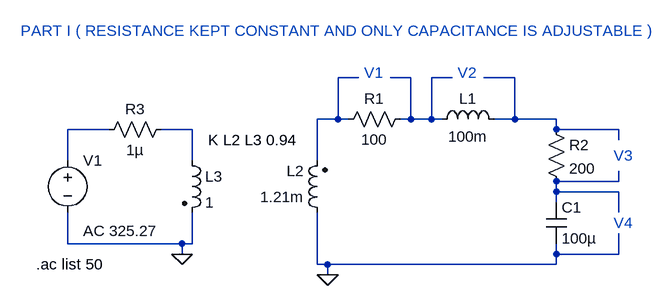
[diagram p0: schematic EXP1_PART1_CIRCUITO1.asc]
EXP1_PART1_CIRCUITO1.asc, the LTspice schematic file:
Version 4
SHEET 1 880 680
WIRE 80 32 48 32
WIRE 160 32 128 32
WIRE 224 32 192 32
WIRE 320 32 272 32
WIRE 48 96 48 32
WIRE 48 96 16 96
WIRE 64 96 48 96
WIRE 160 96 160 32
WIRE 160 96 144 96
WIRE 192 96 192 32
WIRE 192 96 160 96
WIRE 208 96 192 96
WIRE 320 96 320 32
WIRE 320 96 288 96
WIRE 384 96 320 96
WIRE -304 112 -368 112
WIRE -176 112 -224 112
WIRE 384 112 384 96
WIRE 480 112 384 112
WIRE 480 128 480 112
WIRE -368 160 -368 112
WIRE -176 160 -176 112
WIRE 16 160 16 96
WIRE 480 192 480 176
WIRE 480 192 384 192
WIRE 384 208 384 192
WIRE 480 208 384 208
WIRE 384 224 384 208
WIRE 480 240 480 208
WIRE -368 288 -368 240
WIRE -192 288 -368 288
WIRE -176 288 -176 240
WIRE -176 288 -192 288
WIRE -192 304 -192 288
WIRE 384 304 384 288
WIRE 480 304 480 272
WIRE 480 304 384 304
WIRE 16 320 16 240
WIRE 32 320 16 320
WIRE 384 320 384 304
WIRE 384 320 32 320
WIRE 32 336 32 320
FLAG 32 336 0
FLAG -192 304 0
SYMBOL res 160 80 R90
WINDOW 0 0 56 VBottom 2
WINDOW 3 32 56 VTop 2
SYMATTR InstName R1
SYMATTR Value 100
SYMBOL ind 192 112 R270
WINDOW 0 32 56 VTop 2
WINDOW 3 5 56 VBottom 2
SYMATTR InstName L1
SYMATTR Value 100m
SYMBOL res 368 96 R0
SYMATTR InstName R2
SYMATTR Value 200
SYMBOL cap 368 224 R0
SYMATTR InstName C1
SYMATTR Value 100µ
SYMBOL ind2 32 256 R180
WINDOW 0 36 80 Left 2
WINDOW 3 36 40 Left 2
SYMATTR InstName L2
SYMATTR Value 1.21m
SYMATTR Type ind
SYMBOL ind2 -192 144 R0
SYMATTR InstName L3
SYMATTR Value 1
SYMATTR Type ind
SYMBOL res -208 96 R90
WINDOW 0 0 56 VBottom 2
WINDOW 3 32 56 VTop 2
SYMATTR InstName R3
SYMATTR Value 1µ
SYMBOL voltage -368 144 R0
WINDOW 123 24 124 Left 2
WINDOW 39 0 0 Left 0
SYMATTR Value2 AC 325.27
SYMATTR InstName V1
SYMATTR Value ""
TEXT -152 128 Left 2 !K L2 L3 0.94
TEXT -416 320 Left 2 !.ac list 50
TEXT 88 24 Left 2 ;V1
TEXT 232 24 Left 2 ;V2
TEXT 472 152 Left 2 ;V3
TEXT 472 256 Left 2 ;V4
TEXT -440 -40 Left 2 ;PART I ( RESISTANCE KEPT CONSTANT AND ONLY CAPACITANCE IS ADJUSTABLE )

The netlist it stands for:
* EXP1_PART1_CIRCUITO1.asc
R1 N002 N001 100
L1 N002 N003 100m
R2 N003 N006 200
C1 N006 0 100µ
L2 0 N001 1.21m
L3 N005 0 1
R3 N005 N004 1µ
V1 N004 0 AC 325.27
K L2 L3 0.94
.ac list 50
* V1
* V2
* V3
* V4
* PART I ( RESISTANCE KEPT CONSTANT AND ONLY CAPACITANCE IS ADJUSTABLE )
.backanno
.end